# Altium project Placa_principal.PrjPcb
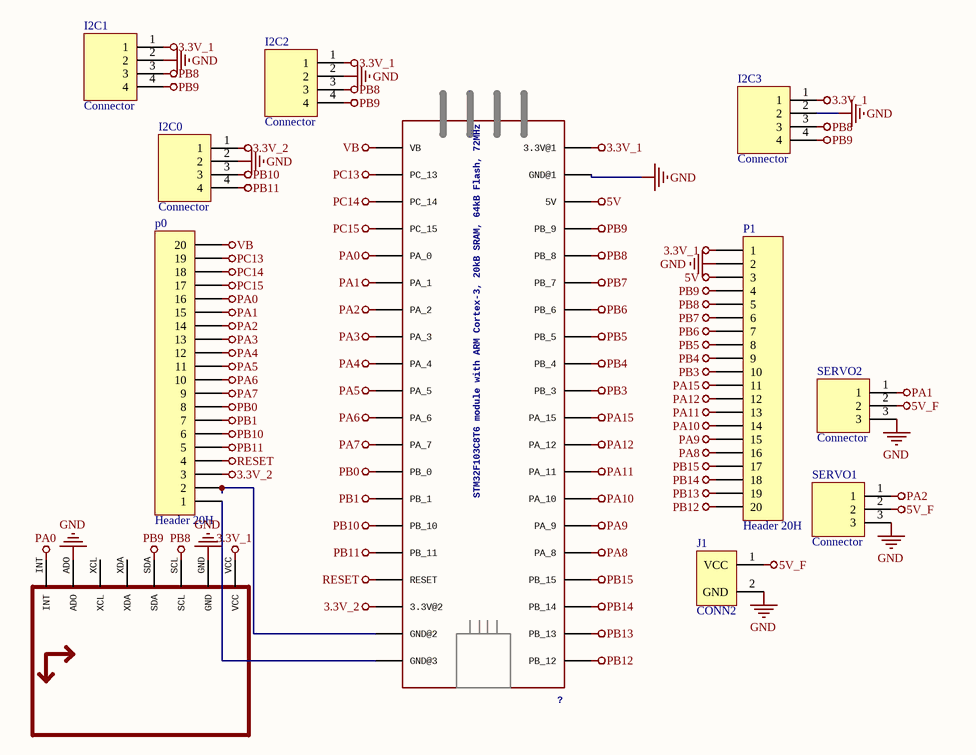
[diagram p0: PrincipalSCH.SchDoc]
1 sheet, 11 parts. Net scope: global (net labels, ports and power ports of the same name join across sheets).
Board file: PrincipalPCB.PcbDoc

## Sheet PrincipalSCH.SchDoc
size A4

### Parts
?  STM32F103C8T6 module with ARM Cortex-3, 20kB SRAM, 64kB Flash, 72MHz  [STM32F103C8T6-MODULE]
I2C0  Connector  [1x4x2.54 Pin Header TH V]
I2C1  Connector  [1x4x2.54 Pin Header TH V]
I2C2  Connector  [1x4x2.54 Pin Header TH V]
I2C3  Connector  [1x4x2.54 Pin Header TH V]
J1  CONN2  [CONN2]
p0  Header 20H  [HDR1X20H]
P1  Header 20H  [HDR1X20H]
SERVO1  Connector  [1x3x2.54 Pin Header TH V]
SERVO2  Connector  [1x3x2.54 Pin Header TH V]
U?  GY-521MPU6050  [GY-521]  (value not drawn)

### Nets
3.3V_1: ?.3.3V_1(3.3V@1) I2C1.1 I2C2.1 I2C3.1 P1.1 U?.VCC
3.3V_2: ?.3.3V_2(3.3V@2) I2C0.1 p0.3
5V: ?.5V P1.3
5V_F: J1.1(VCC) SERVO1.2 SERVO2.2
GND: ?.GND_1(GND@1) I2C0.2 I2C1.2 I2C2.2 I2C3.2 J1.2(GND) P1.2 SERVO1.3 SERVO2.3 U?.ADO U?.GND
PA0: ?.PA_0 p0.16 U?.INT
PA1: ?.PA_1 p0.15 SERVO2.1
PA2: ?.PA_2 p0.14 SERVO1.1
PA3: ?.PA_3 p0.13
PA4: ?.PA_4 p0.12
PA5: ?.PA_5 p0.11
PA6: ?.PA_6 p0.10
PA7: ?.PA_7 p0.9
PA8: ?.PA_8 P1.16
PA9: ?.PA_9 P1.15
PA10: ?.PA_10 P1.14
PA11: ?.PA_11 P1.13
PA12: ?.PA_12 P1.12
PA15: ?.PA_15 P1.11
PB0: ?.PB_0 p0.8
PB1: ?.PB_1 p0.7
PB3: ?.PB_3 P1.10
PB4: ?.PB_4 P1.9
PB5: ?.PB_5 P1.8
PB6: ?.PB_6 P1.7
PB7: ?.PB_7 P1.6
PB8: ?.PB_8 I2C1.3 I2C2.3 I2C3.3 P1.5 U?.SCL
PB9: ?.PB_9 I2C1.4 I2C2.4 I2C3.4 P1.4 U?.SDA
PB10: ?.PB_10 I2C0.3 p0.6
PB11: ?.PB_11 I2C0.4 p0.5
PB12: ?.PB_12 P1.20
PB13: ?.PB_13 P1.19
PB14: ?.PB_14 P1.18
PB15: ?.PB_15 P1.17
PC13: ?.PC_13 p0.19
PC14: ?.PC_14 p0.18
PC15: ?.PC_15 p0.17
RESET: ?.RESET p0.4
VB: ?.VB p0.20
Net?_GND_2: ?.GND_2(GND@2) p0.2
Net?_GND_3: ?.GND_3(GND@3) p0.1

Not connected (* = marked no-connect by the designer): U? XCL XDA

### Library data of the parts
? = STM32F103C8T6-MODULE: GateName_1: G$1; SymbolName_1: STM32F103C8T6-MODULE; LibraryName: stm32f103c8t6_module; DeviceSetName: STM32F103C8T6-MODULE; Package: STM32F103C8T6-MODULE
I2C0-I2C3 = Header 1x4
J1 = Bornera
p0 P1 = Header 20H: Header, 20-Pin, Right Angle; LatestRevisionDate: 17-Jul-2002; LatestRevisionNote: Re-released for DXP Platform.; Publisher: Altium Limited
SERVO1 SERVO2 = Header 1x3
U? = GY-521MPU6050: GateName_1: G$1; SymbolName_1: MPU6050; DeviceName: MPU6050; LibraryName: gy-521; DeviceSetName: GY-521; Package: GY-521